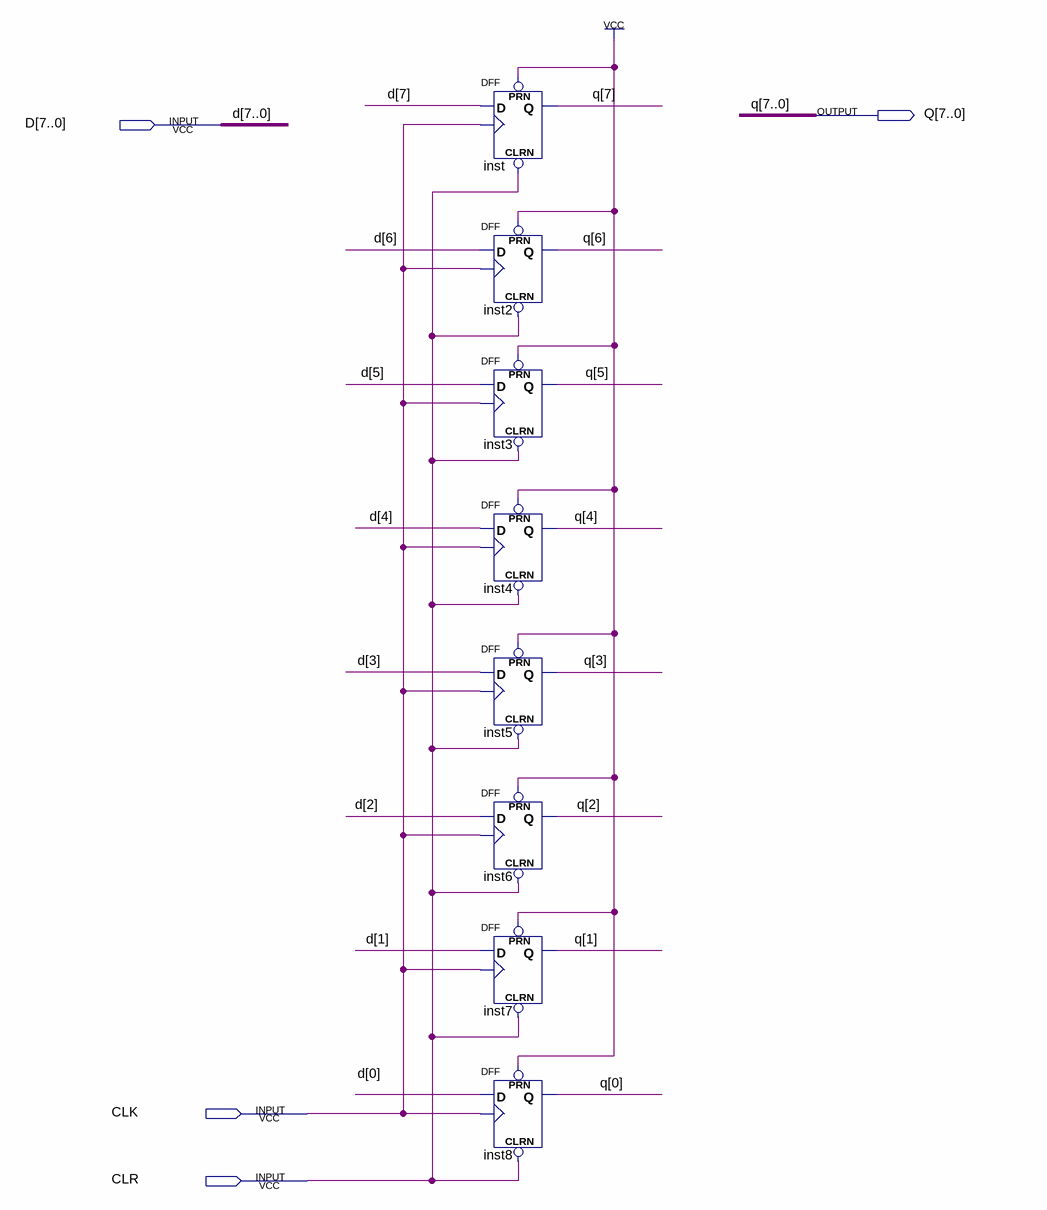
[diagram p0: schematic sheet]
// Quartus schematic Regi.bdf as structural Verilog: 8 symbols, 4 pins
module Regi (
  input  [7:0] D,
  input  CLK,
  input  CLR,
  output [7:0] Q
);

  DFF inst (.CLRN(CLR), .CLK(CLK), .D(D[7]), .PRN(1'b1), .Q(Q[7]));
  DFF inst2 (.CLRN(CLR), .CLK(CLK), .D(D[6]), .PRN(1'b1), .Q(Q[6]));
  DFF inst3 (.CLRN(CLR), .CLK(CLK), .D(D[5]), .PRN(1'b1), .Q(Q[5]));
  DFF inst4 (.CLRN(CLR), .CLK(CLK), .D(D[4]), .PRN(1'b1), .Q(Q[4]));
  DFF inst5 (.CLRN(CLR), .CLK(CLK), .D(D[3]), .PRN(1'b1), .Q(Q[3]));
  DFF inst6 (.CLRN(CLR), .CLK(CLK), .D(D[2]), .PRN(1'b1), .Q(Q[2]));
  DFF inst7 (.CLRN(CLR), .CLK(CLK), .D(D[1]), .PRN(1'b1), .Q(Q[1]));
  DFF inst8 (.CLRN(CLR), .CLK(CLK), .D(D[0]), .PRN(1'b1), .Q(Q[0]));
endmodule
